# Altium schematic sheet FPGA_B34_B35.SchDoc: TE0722
size A4; Organization: Trenz Electronic GmbH; DocumentNumber: 2; Revision: 01; SheetNumber: 2; SheetTotal: 8; Date: 07.11.2014; PageSetup: Record=PageOptions|CenterHorizontal=True|CenterVertical=True|PrintScale=0.96|XCorrection=1.00|YCorrection=1.00|PrintKind=0|BorderSize=5000000|LeftOffset=0|BottomOffset=0|Orientation=2|PaperLength=1000|PaperWidth=1000|Scale=100|PaperSource=7|PrintQuality=-4|MediaType=1|DitherType=10|PaperKind=A4|PrintScaleMode=1
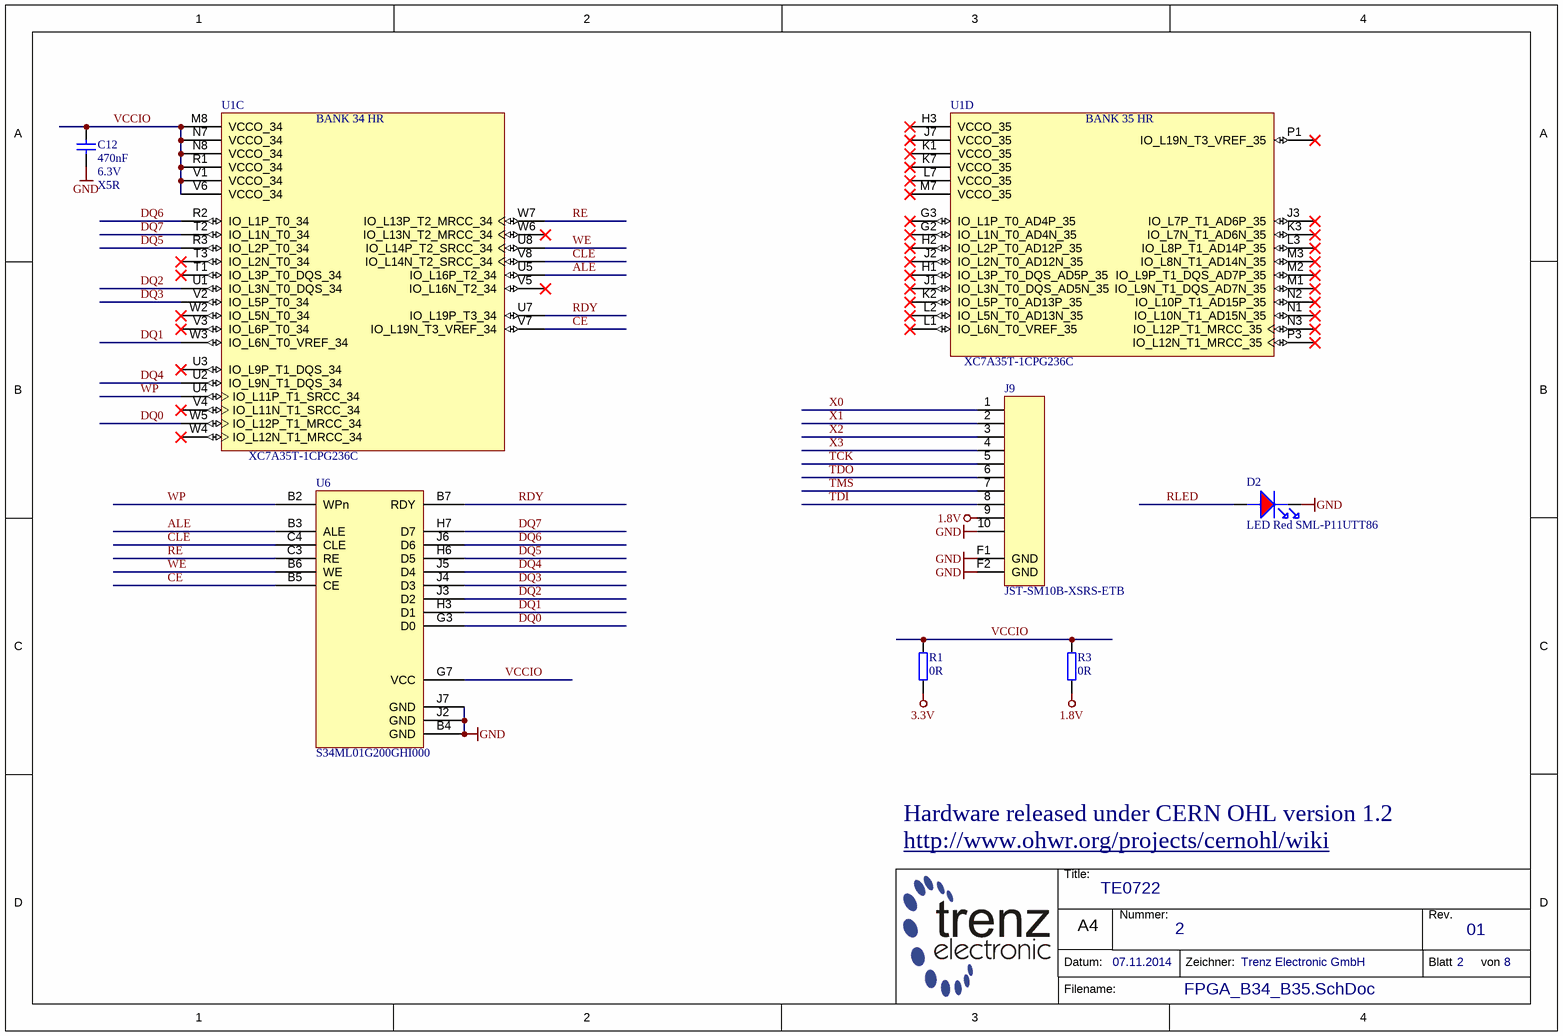
[diagram p0: FPGA_B34_B35.SchDoc]

## Parts
C12  470nF  Voltage: 6.3V  Technology: X5R  [CAPC0603X33N]
D2  LED Red SML-P11UTT86  [LEDC1006X25N_RED]
J9  JST-SM10B-XSRS-ETB  [JST-SM10B-XSRS-ETB]
R1  0R  [RESC0603X26N]
R3  0R  [RESC0603X26N]
U1  XC7A35T-1CPG236C  [XC7AxxT-CPG236]  (parts C,D of 8)
U6  S34ML01G200GHI000  [BGA67C80P10X8_800X650X100B46N]

## Nets
1.8V: J9.9 R3.2
3.3V: R1.2
GND: C12.2 D2.K J9.10 J9.F1(GND) J9.F2(GND) U6.B4(GND) U6.J2(GND) U6.J7(GND)
ALE: U1.U5(IO_L16P_T2_34) U6.B3(ALE)
CE: U1.V7(IO_L19N_T3_VREF_34) U6.B5(CE)
CLE: U1.V8(IO_L14N_T2_SRCC_34) U6.C4(CLE)
DQ0: U1.W5(IO_L12P_T1_MRCC_34) U6.G3(D0)
DQ1: U1.W3(IO_L6N_T0_VREF_34) U6.H3(D1)
DQ2: U1.U1(IO_L3N_T0_DQS_34) U6.J3(D2)
DQ3: U1.V2(IO_L5P_T0_34) U6.J4(D3)
DQ4: U1.U2(IO_L9N_T1_DQS_34) U6.J5(D4)
DQ5: U1.R3(IO_L2P_T0_34) U6.H6(D5)
DQ6: U1.R2(IO_L1P_T0_34) U6.J6(D6)
DQ7: U1.T2(IO_L1N_T0_34) U6.H7(D7)
RDY: U1.U7(IO_L19P_T3_34) U6.B7(RDY)
RE: U1.W7(IO_L13P_T2_MRCC_34) U6.C3(RE)
RLED: D2.A
TCK: J9.5
TDI: J9.8
TDO: J9.6
TMS: J9.7
VCCIO: C12.1 R1.1 R3.1 U1.M8(VCCO_34) U1.N7(VCCO_34) U1.N8(VCCO_34) U1.R1(VCCO_34) U1.V1(VCCO_34) U1.V6(VCCO_34) U6.G7(VCC)
WE: U1.U8(IO_L14P_T2_SRCC_34) U6.B6(WE)
WP: U1.U4(IO_L11P_T1_SRCC_34) U6.B2(WPn)
X0: J9.1
X1: J9.2
X2: J9.3
X3: J9.4

Not connected (* = marked no-connect by the designer): U1 G2(IO_L1N_T0_AD4N_35)* G3(IO_L1P_T0_AD4P_35)* H1(IO_L3P_T0_DQS_AD5P_35)* H2(IO_L2P_T0_AD12P_35)* H3(VCCO_35)* J1(IO_L3N_T0_DQS_AD5N_35)* J2(IO_L2N_T0_AD12N_35)* J3(IO_L7P_T1_AD6P_35)* J7(VCCO_35)* K1(VCCO_35)* K2(IO_L5P_T0_AD13P_35)* K3(IO_L7N_T1_AD6N_35)* K7(VCCO_35)* L1(IO_L6N_T0_VREF_35)* L2(IO_L5N_T0_AD13N_35)* L3(IO_L8P_T1_AD14P_35)* L7(VCCO_35)* M1(IO_L9N_T1_DQS_AD7N_35)* M2(IO_L9P_T1_DQS_AD7P_35)* M3(IO_L8N_T1_AD14N_35)* M7(VCCO_35)* N1(IO_L10N_T1_AD15N_35)* N2(IO_L10P_T1_AD15P_35)* N3(IO_L12P_T1_MRCC_35)* P1(IO_L19N_T3_VREF_35)* P3(IO_L12N_T1_MRCC_35)* T1(IO_L3P_T0_DQS_34)* T3(IO_L2N_T0_34)* U3(IO_L9P_T1_DQS_34)* V3(IO_L6P_T0_34)* V4(IO_L11N_T1_SRCC_34)* V5(IO_L16N_T2_34)* W2(IO_L5N_T0_34)* W4(IO_L12N_T1_MRCC_34)* W6(IO_L13N_T2_MRCC_34)*

## Notes on the sheet
- Hardware released under CERN OHL version 1.2
- http://www.ohwr.org/projects/cernohl/wiki
- Title:
- Nummer:
- Rev.
- Datum:
- A4
- Zeichner:
- Blatt
- von
- Filename:
- (in symbol 26752, part C) BANK 34 HR
- (in symbol 26752, part D) BANK 35 HR

## Library data of the parts
C12 = 24921: KON 470nF X5R 6.3V SMD 20%; AN: 24921; Mixed: SMT; Value: 470n; Preferred: Yes; Case: 0603 (0201); Tolerance: 20%
D2 = 24212: LED Rot SML-P11UTT86 SMD; AN: 24212; Mixed: SMT; Preferred: Yes; Case: 1005 (0402); HelpURL: B:\AD\adlib\datasheet\SML-P1
J9 = 25616: JST 10Pol. 0.6mm RA; AN: 25616; Mixed: SMT; Trenz-Stock: Yes; HelpURL: B:\AD\adlib\datasheet\SMxxB-XSRS-ETB
R1 R3 = 26259: WID SMD 0R 0,05W SMD; AN: 26259; Mixed: SMT; Value: 0; Preferred: Yes; Case: 0603 (0201); HelpURL: B:\AD\adlib\datasheet\R0201
U1 = 26752: AN: 26752; Mixed: SMT; Trenz-Stock: Yes; Case: CPG236; HelpURL: B:\ad\adlib\datasheet\XC7
U6 = 26787: AN: 26787; Mixed: SMT; Trenz-Stock: Yes; Case: BGA67; HelpURL: B:\AD\adlib\datasheet\S34ML0xG2